# Altium schematic sheet Sheet1.SchDoc
size A3; SheetNumber: 1; SheetTotal: 1
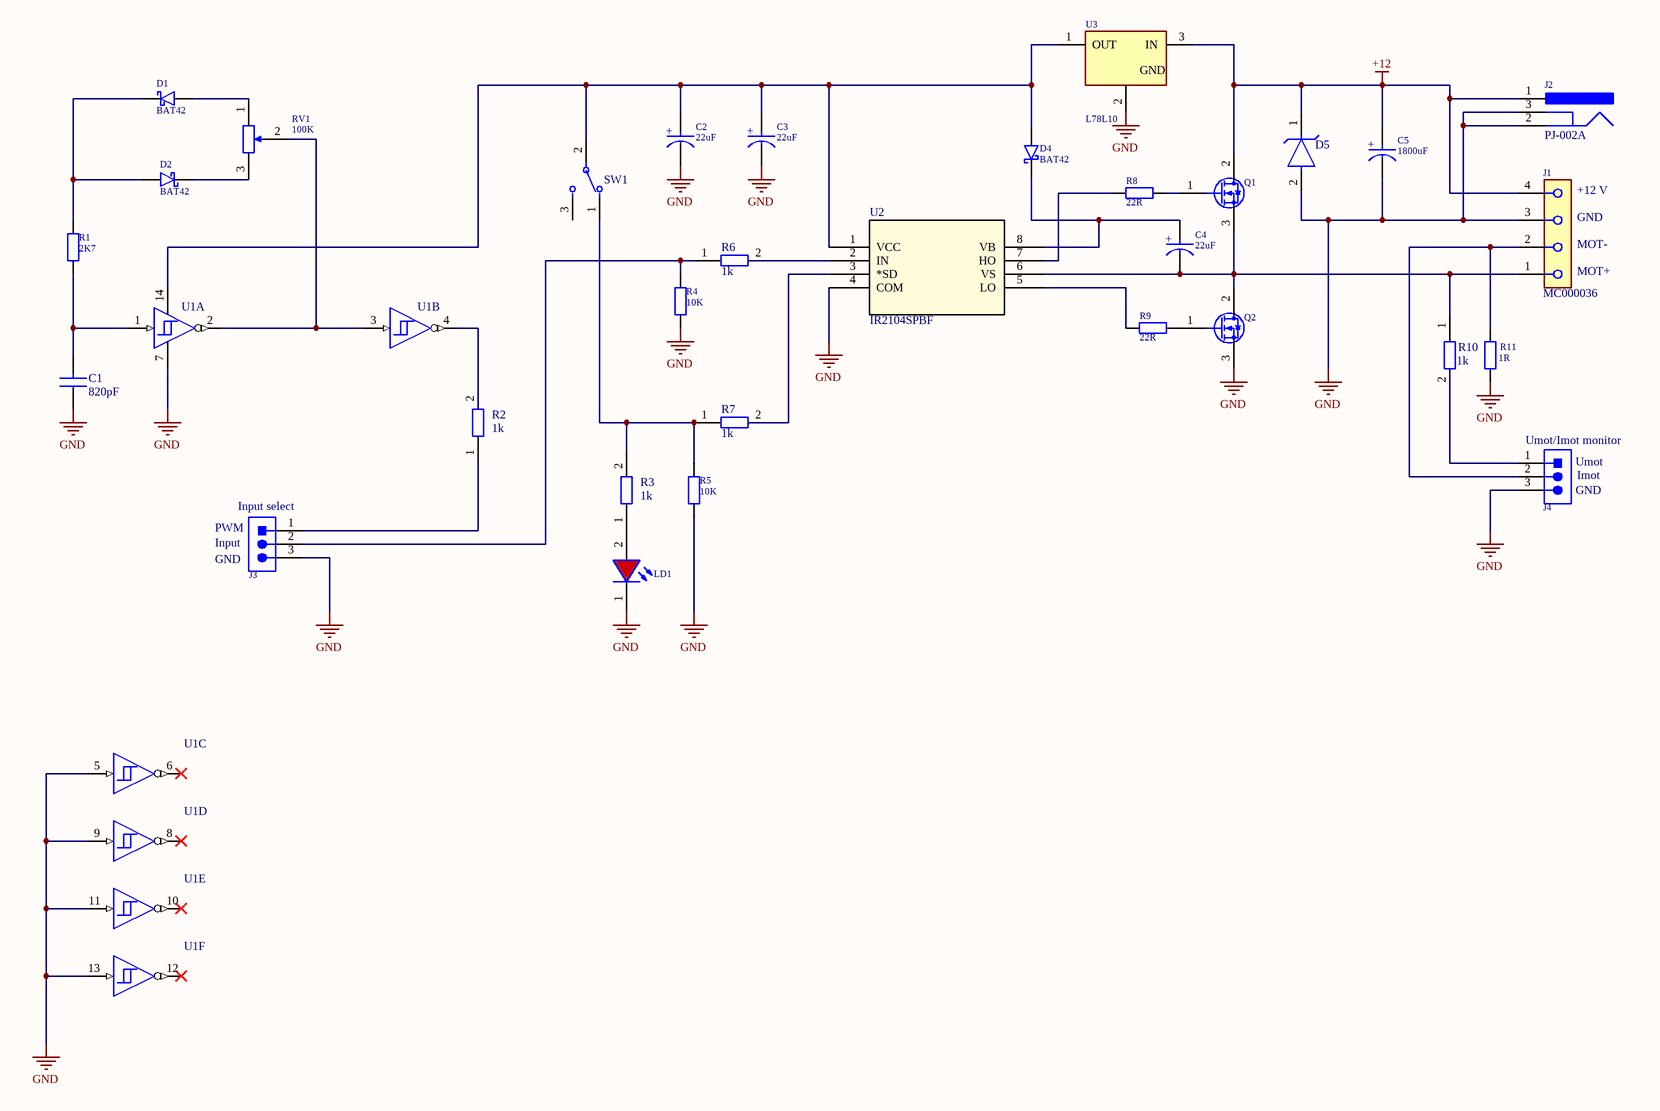
[diagram p0: Sheet1.SchDoc]

## Parts
C1  820pF  [Cap_tht_5mm]
C2  Capacitance: 22uF  [Cap_radial_5mm]  (hidden comment: ECA1EM220I)
C3  Capacitance: 22uF  [Cap_radial_5mm]  (hidden comment: ECA1EM220I)
C4  Capacitance: 22uF  [Cap_radial_5mm]  (hidden comment: ECA1EM220I)
C5  Capacitance: 1800uF  [Cap_Radial_16mm]  (hidden comment: B41896D5188M000)
D1  BAT42  [BAT42]
D2  BAT42  [BAT42]
D4  BAT42  [BAT42]
D5  1N4749ATR  [FP-017AH-MFG]  (value not drawn)
J1  MC000036  [MC000036]
J2  PJ-002A  [DC_jack]
J3  5-146278-3  [TE_5-146278-3]  (value not drawn)
J4  5-146278-3  [TE_5-146278-3]  (value not drawn)
LD1  TLHR5200  [LED_5.0mm]  (value not drawn)
Q1  IRFU3910PBF  [TO-251AA]  (value not drawn)
Q2  IRFU3910PBF  [TO-251AA]  (value not drawn)
R1  2K7  [Res_2k7_Axial_DIN0207]
R2  1k  [resistor_1k]
R3  1k  [resistor_1k]
R4  10K  [Res_10k_Axial_DIN0207]
R5  10K  [Res_10k_Axial_DIN0207]
R6  1k  [resistor_1k]
R7  1k  [resistor_1k]
R8  22R  [Res_22R_Axial_DIN0207]
R9  22R  [Res_22R_Axial_DIN0207]
R10  1k  [resistor_1k]
R11  value 1R  [Res_1R_Axial_DIN0309]  (hidden comment: 1R / 0.5W)
RV1  value 100K  [Potentiometer]  (hidden comment: 14TR08SA104C)
SW1  A201SYCB04  [A201SYCB04]  (value not drawn)
U1  CD40106BE  [DIP762W45P254L1969H508Q14]  (value not drawn)  (parts A,B,C,D,E,F of 6)
U2  IR2104SPBF  [SOIC8_INF-M]
U3  L78L10  [TO-92]

## Nets
+12: C5.2(A) D5.1(C) J1.4 J2.1 Q1.2 U3.3(IN)
GND: C1.2 C2.1(C) C3.1(C) C5.1(C) D5.2(A) J1.3 J2.2 J2.3 J3.3 J4.3 LD1.1(K) Q2.3 R4.2 R5.2 R11.2 U1.5(C) U1.7(VSS) U1.9(D) U1.11(E) U1.13(F) U2.4(COM) U3.2(ADJ/GND)
NetC1_1: C1.1 R1.2 U1.1(A)
NetC2_2: C2.2(A) C3.2(A) D4.2(A) SW1.2 U1.14(VDD) U2.1(VCC) U3.1(OUT)
NetC4_1: C4.1(C) J1.1 Q1.3 Q2.2 R10.1 U2.6(VS)
NetC4_2: C4.2(A) D4.1(K) U2.8(VB)
NetD1_1: D1.1(K) D2.2(A) R1.1
NetD1_2: D1.2(A) RV1.1
NetD2_1: D2.1(K) RV1.3
NetJ1_2: J1.2 J4.2 R11.1
NetJ3_1: J3.1 R2.1
NetJ3_2: J3.2 R4.1 R6.1
NetJ4_1: J4.1 R10.2
NetLD1_2: LD1.2(A) R3.1
NetQ1_1: Q1.1 R8.2
NetQ2_1: Q2.1 R9.2
NetR2_2: R2.2 U1.4(H=~{B})
NetR5_1: R5.1 R7.1 SW1.1
NetR6_2: R6.2 U2.2(IN)
NetR7_2: R7.2 U2.3(*SD)
NetR8_1: R8.1 U2.7(HO)
NetR9_1: R9.1 U2.5(LO)
NetRV1_2: RV1.2 U1.2(G=~{A}) U1.3(B)

Not connected (* = marked no-connect by the designer): R3 2; SW1 3; U1 6(I=~{C})* 8(J=~{D})* 10(K=~{E})* 12(L=~{F})*

## Notes on the sheet
- (near J1) +12 V
- (near J1) GND
- (near J1) MOT-
- (near J1) MOT+
- (near J4) Umot/Imot monitor
- (near J3) Input select
- (near J4) GND
- (near J4) Umot
- (near J4) Imot
- (near J3) PWM
- (near J3) GND
- (near J3) Input
- (in symbol Capacitor Electrolytic 5mm) +
- (in symbol Capacitor Electrolytic 16mm) +
- (in symbol LDO 10V) GND

## Library data of the parts
C1 = Capacitor 820pF: Ceramic Disc Capacitor, 820 pF, 100 V, ± 10%, Y5P, 5 mm, Radial Leaded; Farnell: 2924986; Capacitance: 820pF
C2-C4 = Capacitor Electrolytic 5mm: Electrolytic Capacitor, 22 µF, 25 V, ± 20%, Radial Leaded, 2000 hours @ 85°C, Polar; Farnell: 3888911
C5 = Capacitor Electrolytic 16mm: Electrolytic Capacitor, 1800 µF, 25 V, ± 20%, Radial Leaded, 7000 hours @ 125°C, Polar; Farnell: 2750197
D1 D2 D4 = Schottky diode 30 V: Small Signal Schottky Diode, Single, 30 V, 200 mA, 400 mV, 4 A, 125 °C; Farnell: 9801430; Supplier 1: Mouser; Supplier Part Number 1: 625-BAT42; Value: BAT42
D5 = zener_diode24V: 1N4749ATR 1N4749 Series 24 V 1 W 5 uA Through Hole Zener Diode - DO-41; Manufacturer Lifecycle Status: ACTIVE; NexarPartId: 84408802; ESD Protection: No; Material: Glass; Zener Current: 10.5mA; Peak Reverse Current: 5µA; Power Dissipation: 1W; Voltage Tolerance: 5%; Impedance: 25Ω; Working Voltage: 24V; Max Junction Temperature (Tj): 200°C; Element Configuration: Single; Reverse Voltage: 18.2V; Output Current: 2.4A; Length: 5.2mm; Number of Pins: 2; Max Reverse Leakage Current: 5µA; Weight: 245mg; Max Operating Temperature: 200°C; RoHS: Compliant; Lead Free: Lead Free; Mount: Through Hole; Power Rating: 1W; Tolerance: 5%; REACH SVHC: No SVHC; Min Operating Temperature: -65°C; Schedule B: 8541100050, 8541100050|8541100050, 8541100050|8541100050|8541100050, 8541100050|8541100050|8541100050|8541100050; Radiation Hardening: No; Contact Plating: Tin; Packaging: Cut Tape; Lifecycle Status: Production; Test Current: 10.5mA; Zener Voltage: 24V; Height: 2.72mm; Diameter: 2.72mm; Voltage Rating (DC): 24V; Max Power Dissipation: 1W
J1 = Screw terminal: MULTICOMP PRO MC000036Wire-To-Board Terminal Block, 5.08 mm, 4 Ways, 26 AWG, 12 AWG, 4 mm², Screw; Farnell: 2008006
J2 = Power Jack: Through Hole Right Angle DC Power Jack, 2.5 A, 2 mm Center Pin, 3 Position, -25 to 85 degC, RoHS, Bulk; Manufacturer: CUIInc.; Brand: CUI; Inside Contact Diameter: 2mm; Voltage Rating: 24V; Outside Contact Diameter: 6.5mm; Current Rating: 2.5A; Insulation Resistance: 50MOhms; Contact Gender: Male; Connector Type: DCPowerJack; Datasheet Version: Rev. 1.03, 04/2016; Housing Material: PolybutyleneTerephthalate(PBT); Operating Temperature Range: -25Cto+85C; Termination Style: ThroughHole; Product Category: DCPowerConnectors; Mounting Technology: ThroughHole; Mounting Style: ThroughHole; Factory Pack Quantity: 500; Contact Plating: Nickel; Package Reference: PJ-002A; Mounting Angle: Right; Package Description: 3-Pin Through Hole Device, Body 14.4 x 9 mm, Height 11 mm; Flammability Rating: UL94V-0; Manufacturer URL: http://www.cui.com/; Product: Jacks; Contact Material: Copper; Datasheet URL: http://www.cui.com/product/resource/pj-002a.pdf; RoHS: True; Mouser: 490-PJ-002A
J3 J4 = Header 3x1M: Pin Header, Board-to-Board, 2.54 mm, 1 Rows, 3 Contacts, Through Hole Straight, AMPMODU II Series; ComponentLink1Description: Datasheet URL; ComponentLink1URL: http://www.te.com/commerce/DocumentDelivery/DDEController?Action=srchrtrv&DocNm=146278&DocType=Customer+Drawing&DocLang=English; Farnell: 3791596
LD1 = LED Red: LED, Red, Through Hole, T-1 3/4 (5mm), 20 mA, 2 V, 635 nm; ComponentLink1URL: https://www.farnell.com/datasheets/2049871.pdf; ComponentLink1Description: Datasheet link; Farnell: 1045479
Q1 Q2 = MOSFET N-channel 16A: Power MOSFET, N Channel, 100 V, 16 A, 0.115 ohm, TO-251AA, Through Hole; Farnell: 3155148
R1 = Res_2k7: Footprint: Resistor_THT:R_Axial_DIN0207_L6.3mm_D2.5mm_P10.16mm_Horizontal; Value: 2K7
R2 R3 R6 R7 R10 = R1k: 1k: 1k
R4 R5 = Res_10k: Footprint: Resistor_THT:R_Axial_DIN0207_L6.3mm_D2.5mm_P10.16mm_Horizontal; Value: 10K
R8 R9 = Res_22R: Footprint: Resistor_THT:R_Axial_DIN0207_L6.3mm_D2.5mm_P10.16mm_Horizontal; Value: 22R
R11 = Res_1R: Footprint: Resistor_THT:R_Axial_DIN0309_L9.0mm_D3.2mm_P12.70mm_Horizontal
RV1 = Trimmer: Footprint: Potentiometer_THT:Potentiometer_Piher_PT-15-V15_Vertical
SW1 = Toggle Switch: Toggle Switch, On-On, DPDT, Non Illuminated, GEMINI, Panel Mount; Farnell: 1197677
U1 = Schmitt trigger: Logic IC, Inverter, Hex, 1 Inputs, 14 Pins, DIP, 40106; Farnell: 3120105; Supplier 1: Mouser; Supplier Part Number 1: 595-CD40106BE
U2 = IR2104SPBF: No Description Available; Mfr_Name: Infineon; RefDes: RefDes; Type: Type
U3 = LDO 10V: Linear Voltage Regulator, Fixed, 16V to 35V Input, 10V/100mA Out, TO-92; Footprint: Package_TO_SOT_THT:TO-92_HandSolder; Value: L78L10